# Altium schematic sheet Sheet1.SchDoc
size A3
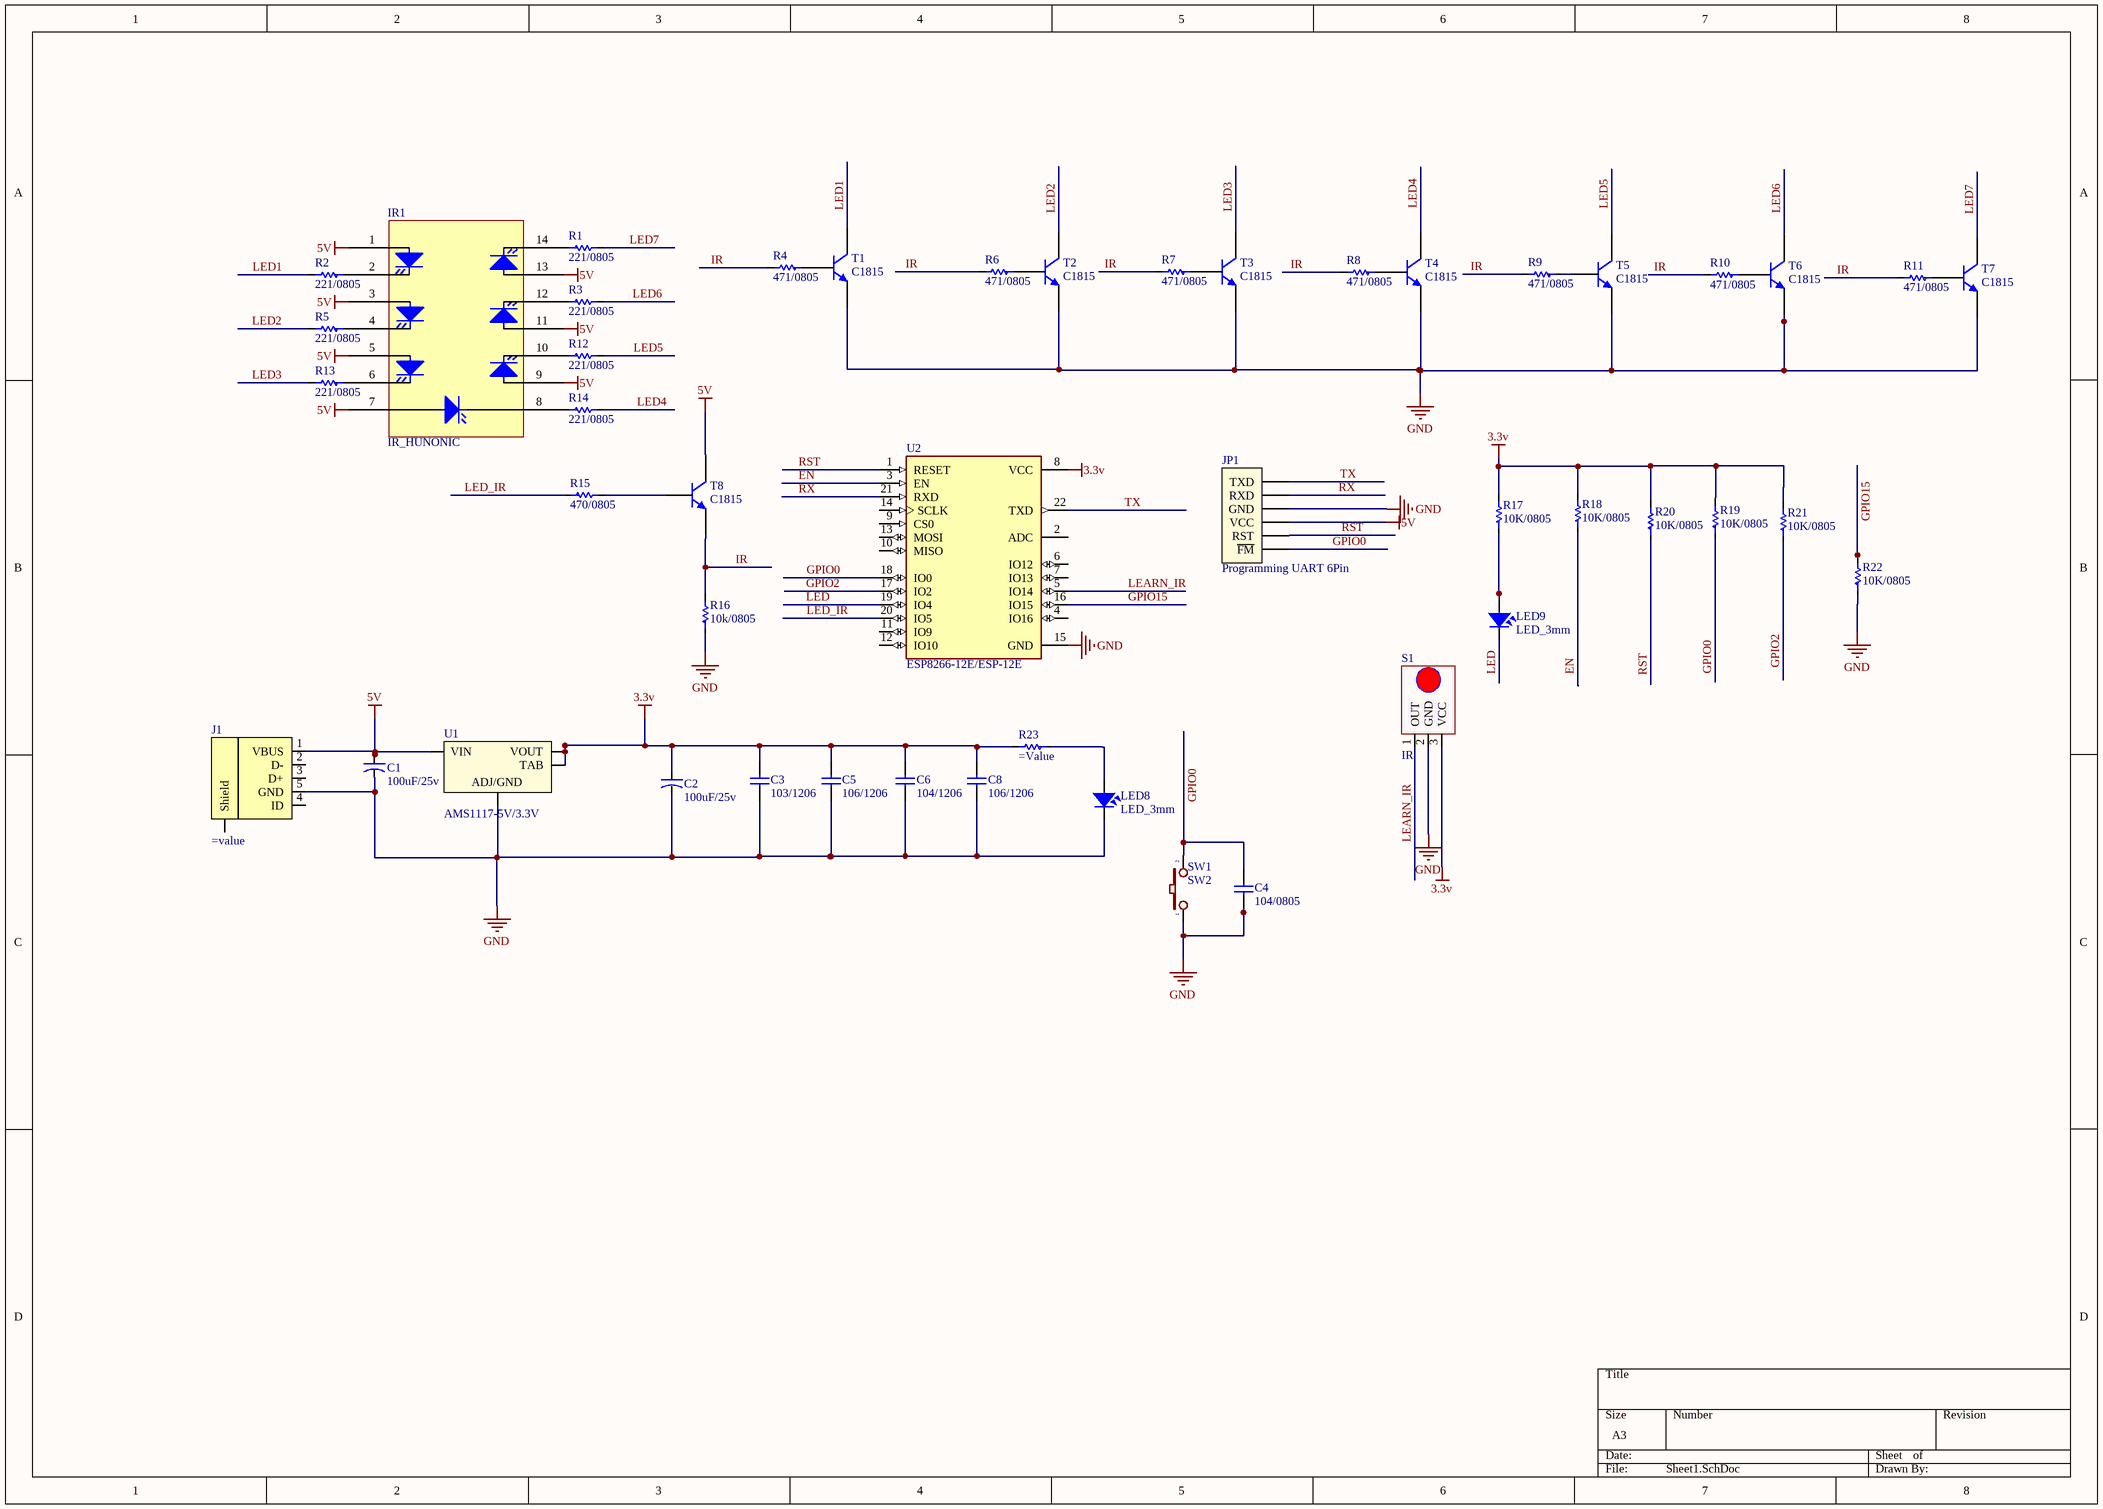
[diagram p0: Sheet1.SchDoc]

## Parts
C1  100uF/25v  [CA-ALU-2.54]
C2  100uF/25v  [CA-ALU-2.54]
C3  103/1206  [SM-Cap-1206]
C4  104/0805  [SM-CAP-0805]
C5  106/1206  [SM-Cap-1206]
C6  104/1206  [SM-Cap-1206]
C8  106/1206  [SM-Cap-1206]
IR1  IR_HUNONIC  [PCBComponent_1]
J1  (no value)  [USB-Micro-B-RA-SMD-PiP - duplicate]
JP1  Programming UART 6Pin  [JP6 2.54 No3D]
LED8  LED_3mm  [LED-3]
LED9  LED_3mm  [LED-3]
R1  221/0805  [SM-RES-0805]
R2  221/0805  [SM-RES-0805]
R3  221/0805  [SM-RES-0805]
R4  471/0805  [SM-RES-0805]
R5  221/0805  [SM-RES-0805]
R6  471/0805  [SM-RES-0805]
R7  471/0805  [SM-RES-0805]
R8  471/0805  [SM-RES-0805]
R9  471/0805  [SM-RES-0805]
R10  471/0805  [SM-RES-0805]
R11  471/0805  [SM-RES-0805]
R12  221/0805  [SM-RES-0805]
R13  221/0805  [SM-RES-0805]
R14  221/0805  [SM-RES-0805]
R15  470/0805  [SM-RES-0805]
R16  10k/0805  [SM-RES-0805]
R17  10K/0805  [SM-RES-0805]
R18  10K/0805  [SM-RES-0805]
R19  10K/0805  [SM-RES-0805]
R20  10K/0805  [SM-RES-0805]
R21  10K/0805  [SM-RES-0805]
R22  10K/0805  [SM-RES-0805]
R23  (no value)  [SM-RES-0805]
S1  IR  [JP3-C1T]
SW1  SW2  [Button-inclined-2C]
T1  C1815  [c1815 dan]
T2  C1815  [c1815 dan]
T3  C1815  [c1815 dan]
T4  C1815  [c1815 dan]
T5  C1815  [c1815 dan]
T6  C1815  [c1815 dan]
T7  C1815  [c1815 dan]
T8  C1815  [c1815 dan]
U1  AMS1117-5V/3.3V  [SOT-223]
U2  ESP8266-12E/ESP-12E  [XCVR_ESP8266-12E/ESP-12E]

## Nets
3.3v: C2.1 C3.2 C5.2 C6.2 C8.2 R17.2 R18.2 R19.2 R20.2 R21.2 R23.2 S1.3(VCC) U1.2(VOUT) U1.4(TAB) U2.8(VCC)
5V: C1.1 IR1.1 IR1.3 IR1.5 IR1.7 IR1.9 IR1.11 IR1.13 J1.1(VBUS) JP1.4(VCC) T8.2(C) U1.3(VIN)
GND: C1.2 C2.2 C3.1 C4.1 C5.1 C6.1 C8.1 J1.5(GND) JP1.3(GND) LED8.2 R16.1 R22.1 S1.2(GND) SW1.0 SW1.1 T1.1(E) T2.1(E) T3.1(E) T4.1(E) T5.1(E) T6.1(E) T7.1(E) U1.1(ADJ/GND) U2.15(GND)
EN: R18.1 U2.3(EN)
GPIO0: C4.2 JP1.6(~{FM}) R19.1 SW1.2 U2.18(IO0)
GPIO2: R21.1 U2.17(IO2)
GPIO15: R22.2 U2.16(IO15)
IR: R4.2 R6.2 R7.2 R8.2 R9.2 R10.2 R11.2 R16.2 T8.1(E)
LEARN_IR: S1.1(OUT) U2.5(IO14)
LED: LED9.2 U2.19(IO4)
LED1: R2.2 T1.2(C)
LED2: R5.2 T2.2(C)
LED3: R13.2 T3.2(C)
LED4: R14.2 T4.2(C)
LED5: R12.2 T5.2(C)
LED6: R3.2 T6.2(C)
LED7: R1.2 T7.2(C)
LED_IR: R15.1 U2.20(IO5)
RST: JP1.5(RST) R20.1 U2.1(RESET)
RX: JP1.2(RXD) U2.21(RXD)
TX: JP1.1(TXD) U2.22(TXD)
NetIR1_2: IR1.2 R2.1
NetIR1_4: IR1.4 R5.1
NetIR1_6: IR1.6 R13.1
NetIR1_8: IR1.8 R14.1
NetIR1_10: IR1.10 R12.1
NetIR1_12: IR1.12 R3.1
NetIR1_14: IR1.14 R1.1
NetLED8_1: LED8.1 R23.1
NetLED9_1: LED9.1 R17.1
NetR4_1: R4.1 T1.3(B)
NetR6_1: R6.1 T2.3(B)
NetR7_1: R7.1 T3.3(B)
NetR8_1: R8.1 T4.3(B)
NetR9_1: R9.1 T5.3(B)
NetR10_1: R10.1 T6.3(B)
NetR11_1: R11.1 T7.3(B)
NetR15_2: R15.2 T8.3(B)

Not connected (* = marked no-connect by the designer): J1 2(D-) 3(D+) 4(ID) 6(Shield); U2 2(ADC) 4(IO16) 6(IO12) 7(IO13) 9(CS0) 10(MISO) 11(IO9) 12(IO10) 13(MOSI) 14(SCLK)

## Library data of the parts
C1 C2 = CN-ALU-DIP: Capacitor (Semiconductor SIM Model); Value: 104; LatestRevisionDate: 17-Jul-2002; LatestRevisionNote: Re-released for DXP Platform.; PackageReference: C1206; Publisher: Altium Limited
C3-C6 C8 = Capacitor SMD: Capacitor SMD 0402 - 1206
J1 = MiniUSB-AB-SMT: MicroUSB-B-SMT
JP1 = Programming UART 6Pin: Programming SWD
R1-R23 = Resistor SMD: Res SMD
S1 = IR: VISHAY SEMICONDUCTOR   TSOP31238   IR RECEIVER, 40M, 38KHZ, SIP
SW1 = SW2: SW
T1-T8 = C1815: C1815 dan
U1 = AMS1117: IC on ap 5V/3.3V; ComponentLink1Description: Datasheet; ComponentLink1URL: http://www.ti.com/lit/ds/symlink/lm1117.pdf
U2 = ESP8266-12E/ESP-12E: This WiFi module has a 32-bit MCU micro and clock speeds supporting 80 MHz or 160 MHz. Supports the RTOS and integrated Wi-Fi MAC/BB/RF/PA/LNA, and has an on-board antenna.; MF: AI-Thinker; Price: None; Package: None; Value: *; MP: ESP8266-12E/ESP-12E; Availability: Unavailable; SnapEDA_Link: https://www.snapeda.com/parts/ESP8266-12E/ESP-12E/AI-Thinker/view-part/106414/?ref=snap